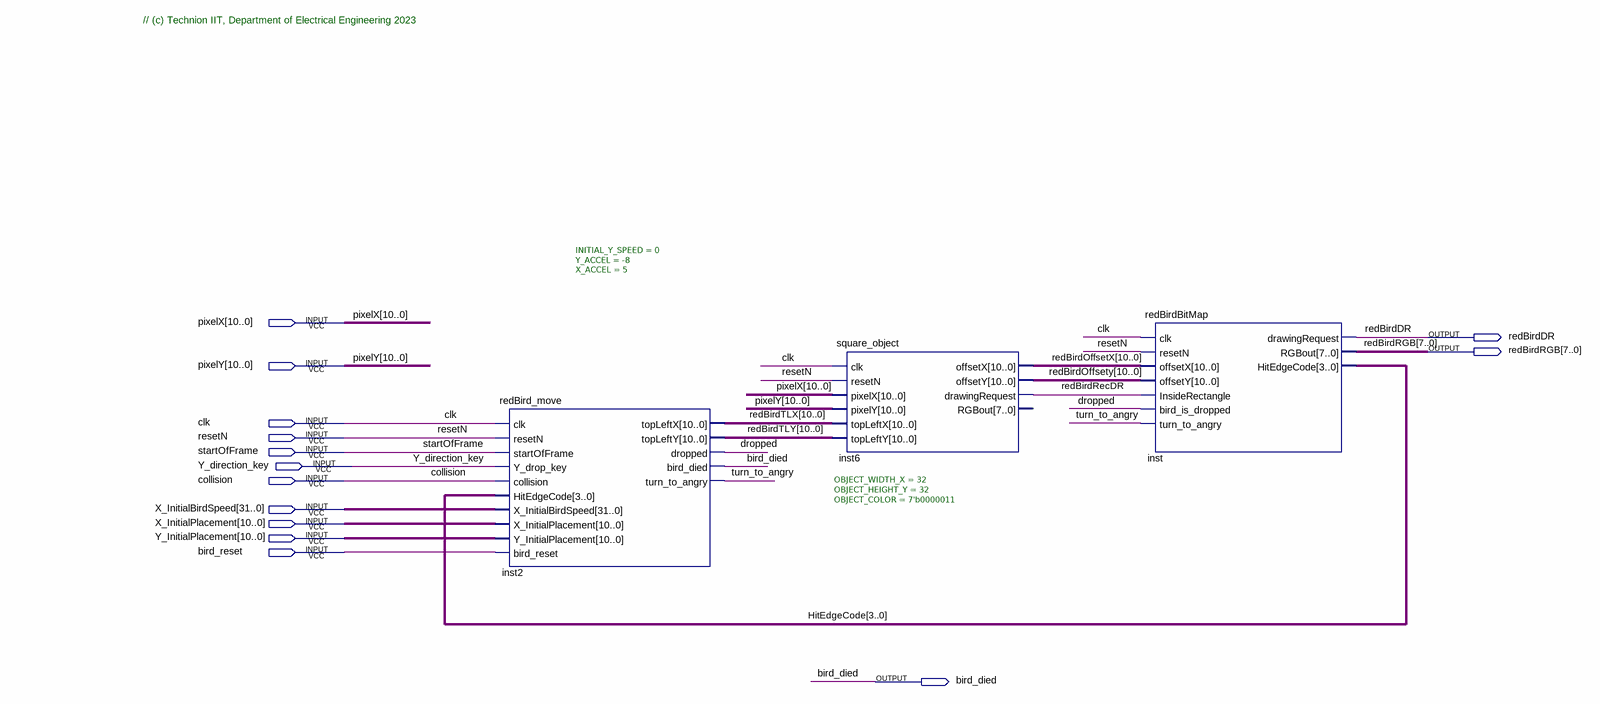
[diagram p0: schematic sheet]
// Quartus schematic RedBird_Block_T.bdf as structural Verilog: 3 symbols, 14 pins
module RedBird_Block_T (
  input  [10:0] pixelX,
  input  [10:0] pixelY,
  input  clk,
  input  resetN,
  input  startOfFrame,
  input  Y_direction_key,
  input  collision,
  input  [31:0] X_InitialBirdSpeed,
  input  [10:0] X_InitialPlacement,
  input  [10:0] Y_InitialPlacement,
  input  bird_reset,
  output redBirdDR,
  output [7:0] redBirdRGB,
  output bird_died
);

  wire dropped, redBirdRecDR, turn_to_angry;
  wire [3:0] HitEdgeCode;
  wire [10:0] redBirdOffsetX, redBirdOffsety, redBirdTLX, redBirdTLY;

  redBird_move #(.INITIAL_Y_SPEED(0), .Y_ACCEL(-8), .X_ACCEL(5)) inst2 (
    .clk(clk), .resetN(resetN), .startOfFrame(startOfFrame), .Y_drop_key(Y_direction_key),
    .collision(collision), .HitEdgeCode(HitEdgeCode), .X_InitialBirdSpeed(X_InitialBirdSpeed),
    .X_InitialPlacement(X_InitialPlacement), .Y_InitialPlacement(Y_InitialPlacement),
    .bird_reset(bird_reset), .topLeftX(redBirdTLX), .topLeftY(redBirdTLY), .dropped(dropped),
    .bird_died(bird_died), .turn_to_angry(turn_to_angry));
  square_object #(.OBJECT_WIDTH_X(32), .OBJECT_HEIGHT_Y(32), .OBJECT_COLOR(7'b0000011)) inst6 (
    .clk(clk), .resetN(resetN), .pixelX(pixelX), .pixelY(pixelY), .topLeftX(redBirdTLX),
    .topLeftY(redBirdTLY), .offsetX(redBirdOffsetX), .offsetY(redBirdOffsety), .drawingRequest(redBirdRecDR));  // open: RGBout
  redBirdBitMap inst (
    .clk(clk), .resetN(resetN), .offsetX(redBirdOffsetX), .offsetY(redBirdOffsety),
    .InsideRectangle(redBirdRecDR), .bird_is_dropped(dropped), .turn_to_angry(turn_to_angry),
    .drawingRequest(redBirdDR), .RGBout(redBirdRGB), .HitEdgeCode(HitEdgeCode));

  // Notes on the sheet:
  //   // (c) Technion IIT, Department of Electrical Engineering 2023
endmodule
